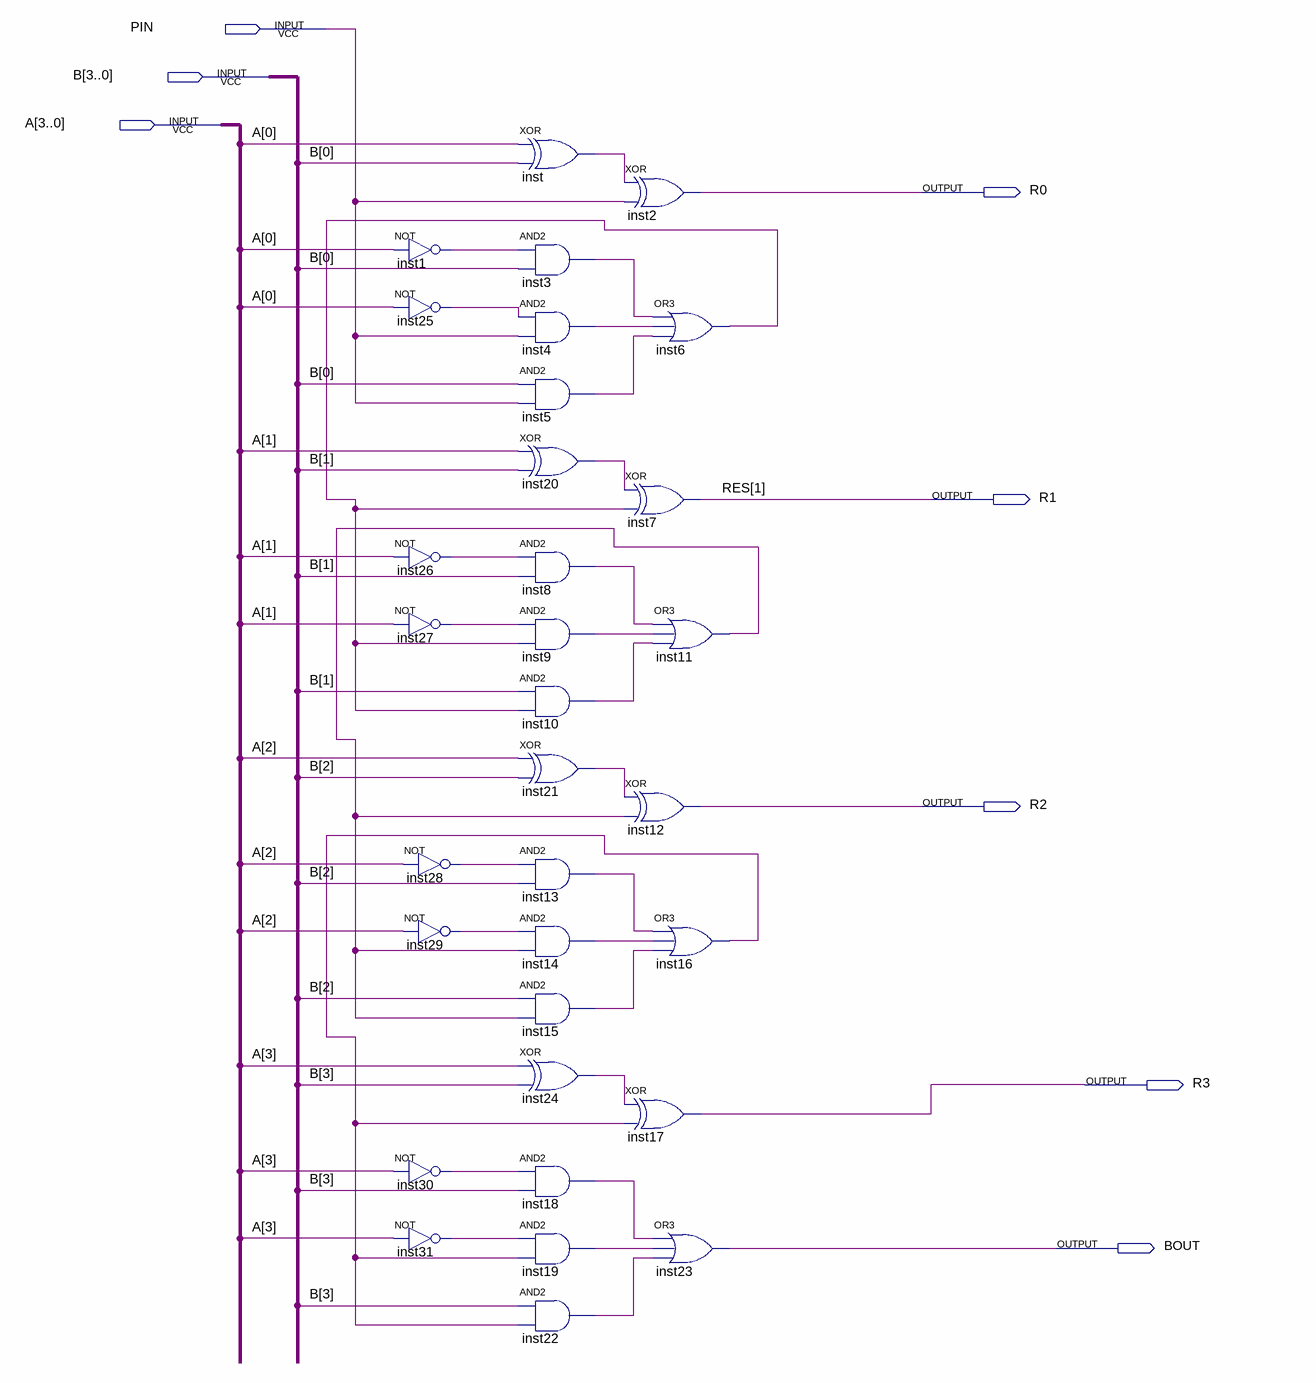
[diagram p0: schematic sheet]
// Quartus schematic Res_4B.bdf as structural Verilog: 32 symbols, 8 pins
module Res_4B (
  input  PIN,
  input  [3:0] B,
  input  [3:0] A,
  output R0,
  output R1,
  output R2,
  output R3,
  output BOUT
);

  wire inst1_out, inst3_out, inst4_out, inst5_out, inst6_out, inst8_out, inst9_out, inst10_out, inst11_out,
       inst13_out, inst14_out, inst15_out, inst16_out, inst18_out, inst19_out, inst20_out, inst21_out,
       inst22_out, inst24_out, inst25_out, inst26_out, inst27_out, inst28_out, inst29_out, inst30_out,
       inst31_out, inst_out;

  not inst1 (inst1_out, A[0]);
  not inst25 (inst25_out, A[0]);
  not inst26 (inst26_out, A[1]);
  not inst27 (inst27_out, A[1]);
  not inst28 (inst28_out, A[2]);
  not inst29 (inst29_out, A[2]);
  not inst30 (inst30_out, A[3]);
  not inst31 (inst31_out, A[3]);
  xor inst (inst_out, A[0], B[0]);
  and inst3 (inst3_out, inst1_out, B[0]);
  and inst4 (inst4_out, inst25_out, PIN);
  and inst5 (inst5_out, B[0], PIN);
  xor inst20 (inst20_out, A[1], B[1]);
  and inst8 (inst8_out, inst26_out, B[1]);
  and inst9 (inst9_out, inst27_out, inst6_out);
  and inst10 (inst10_out, B[1], inst6_out);
  xor inst21 (inst21_out, A[2], B[2]);
  and inst13 (inst13_out, inst28_out, B[2]);
  and inst14 (inst14_out, inst29_out, inst11_out);
  and inst15 (inst15_out, B[2], inst11_out);
  xor inst24 (inst24_out, A[3], B[3]);
  and inst18 (inst18_out, inst30_out, B[3]);
  and inst19 (inst19_out, inst31_out, inst16_out);
  and inst22 (inst22_out, B[3], inst16_out);
  xor inst2 (R0, inst_out, PIN);
  or inst6 (inst6_out, inst3_out, inst4_out, inst5_out);
  xor inst7 (R1, inst20_out, inst6_out);
  or inst11 (inst11_out, inst8_out, inst9_out, inst10_out);
  xor inst12 (R2, inst21_out, inst11_out);
  or inst16 (inst16_out, inst13_out, inst14_out, inst15_out);
  xor inst17 (R3, inst24_out, inst16_out);
  or inst23 (BOUT, inst18_out, inst19_out, inst22_out);

  // Other names for the same wires on the sheet: RES[1] = R1
endmodule
